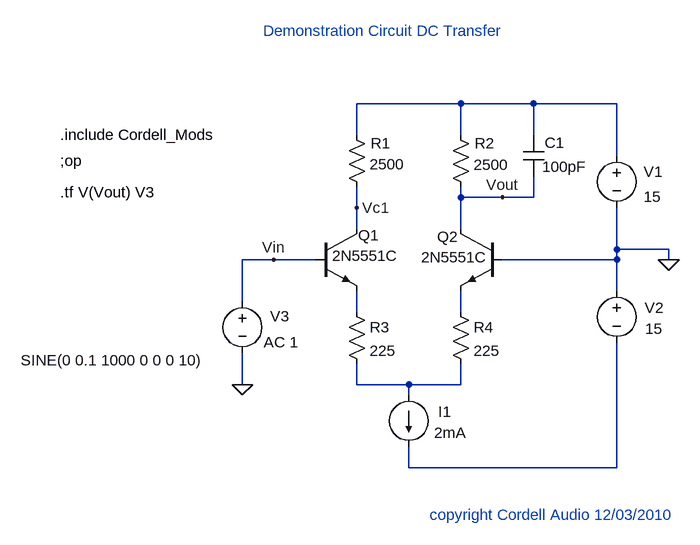
[diagram p0: schematic Demonstration_circuit_DC_Transfer.asc]
Demonstration_circuit_DC_Transfer.asc, the LTspice schematic file:
Version 4
SHEET 1 880 780
WIRE 160 64 0 64
WIRE 272 64 160 64
WIRE 400 64 272 64
WIRE 0 112 0 64
WIRE 160 112 160 64
WIRE 272 112 272 64
WIRE 400 144 400 64
WIRE 160 208 160 192
WIRE 224 208 160 208
WIRE 272 208 272 176
WIRE 272 208 224 208
WIRE 0 224 0 192
WIRE 0 256 0 224
WIRE 160 256 160 208
WIRE 400 288 400 224
WIRE 480 288 400 288
WIRE -128 304 -176 304
WIRE -64 304 -128 304
WIRE 400 304 400 288
WIRE 400 304 224 304
WIRE 480 304 480 288
WIRE 400 352 400 304
WIRE -176 368 -176 304
WIRE 0 384 0 352
WIRE 160 384 160 352
WIRE -176 496 -176 448
WIRE 0 496 0 464
WIRE 80 496 0 496
WIRE 160 496 160 464
WIRE 160 496 80 496
WIRE 80 512 80 496
WIRE 80 624 80 592
WIRE 400 624 400 432
WIRE 400 624 80 624
FLAG 480 304 0
FLAG -176 496 0
FLAG -128 304 Vin
FLAG 224 208 Vout
FLAG 0 224 Vc1
SYMBOL res -16 96 R0
WINDOW 0 37 29 Left 0
WINDOW 3 36 61 Left 0
SYMATTR InstName R1
SYMATTR Value 2500
SYMBOL res 144 96 R0
WINDOW 0 37 29 Left 0
WINDOW 3 36 62 Left 0
SYMATTR InstName R2
SYMATTR Value 2500
SYMBOL voltage 400 128 R0
WINDOW 123 0 0 Left 0
WINDOW 39 0 0 Left 0
WINDOW 0 41 41 Left 0
WINDOW 3 41 79 Left 0
SYMATTR InstName V1
SYMATTR Value 15
SYMBOL voltage 400 336 R0
WINDOW 123 0 0 Left 0
WINDOW 39 0 0 Left 0
WINDOW 0 43 42 Left 0
WINDOW 3 44 74 Left 0
SYMATTR InstName V2
SYMATTR Value 15
SYMBOL npn -64 256 R0
WINDOW 3 26 42 Left 0
WINDOW 0 66 10 Left 0
SYMATTR Value 2N5551C
SYMATTR InstName Q1
SYMBOL npn 224 256 M0
WINDOW 3 23 44 Left 0
WINDOW 0 68 13 Left 0
SYMATTR Value 2N5551C
SYMATTR InstName Q2
SYMBOL res -16 368 R0
SYMATTR InstName R3
SYMATTR Value 225
SYMBOL res 144 368 R0
SYMATTR InstName R4
SYMATTR Value 225
SYMBOL current 80 512 R0
WINDOW 123 0 0 Left 0
WINDOW 39 0 0 Left 0
WINDOW 0 45 26 Left 0
WINDOW 3 39 58 Left 0
SYMATTR InstName I1
SYMATTR Value 2mA
SYMBOL voltage -176 352 R0
WINDOW 3 -341 107 Left 0
WINDOW 123 33 79 Left 0
WINDOW 39 0 0 Left 0
WINDOW 0 43 39 Left 0
SYMATTR Value SINE(0 0.1 1000 0 0 0 10)
SYMATTR Value2 AC 1
SYMATTR InstName V3
SYMBOL cap 256 112 R0
WINDOW 3 29 49 Left 0
WINDOW 0 33 12 Left 0
SYMATTR Value 100pF
SYMATTR InstName C1
TEXT -456 152 Left 0 !;op
TEXT -144 -48 Left 0 ;Demonstration Circuit DC Transfer
TEXT -456 200 Left 0 !.tf V(Vout) V3
TEXT -456 112 Left 0 !.include Cordell_Mods
TEXT 112 696 Left 0 ;copyright Cordell Audio 12/03/2010

The netlist it stands for:
* Demonstration_circuit_DC_Transfer.asc
R1 N001 Vc1 2500
R2 N001 Vout 2500
V1 N001 0 15
V2 0 N005 15
Q1 Vc1 Vin N002 0 2N5551C
Q2 Vout 0 N003 0 2N5551C
R3 N002 N004 225
R4 N003 N004 225
I1 N004 N005 2mA
V3 Vin 0 SINE(0 0.1 1000 0 0 0 10) AC 1
C1 N001 Vout 100pF
.model NPN NPN
.model PNP PNP
.lib standard.bjt
;op
* Demonstration Circuit DC Transfer
.tf V(Vout) V3
.include Cordell_Mods
* copyright Cordell Audio 12/03/2010
.backanno
.end